# EAGLE design sighdo (EAGLE 5.10)
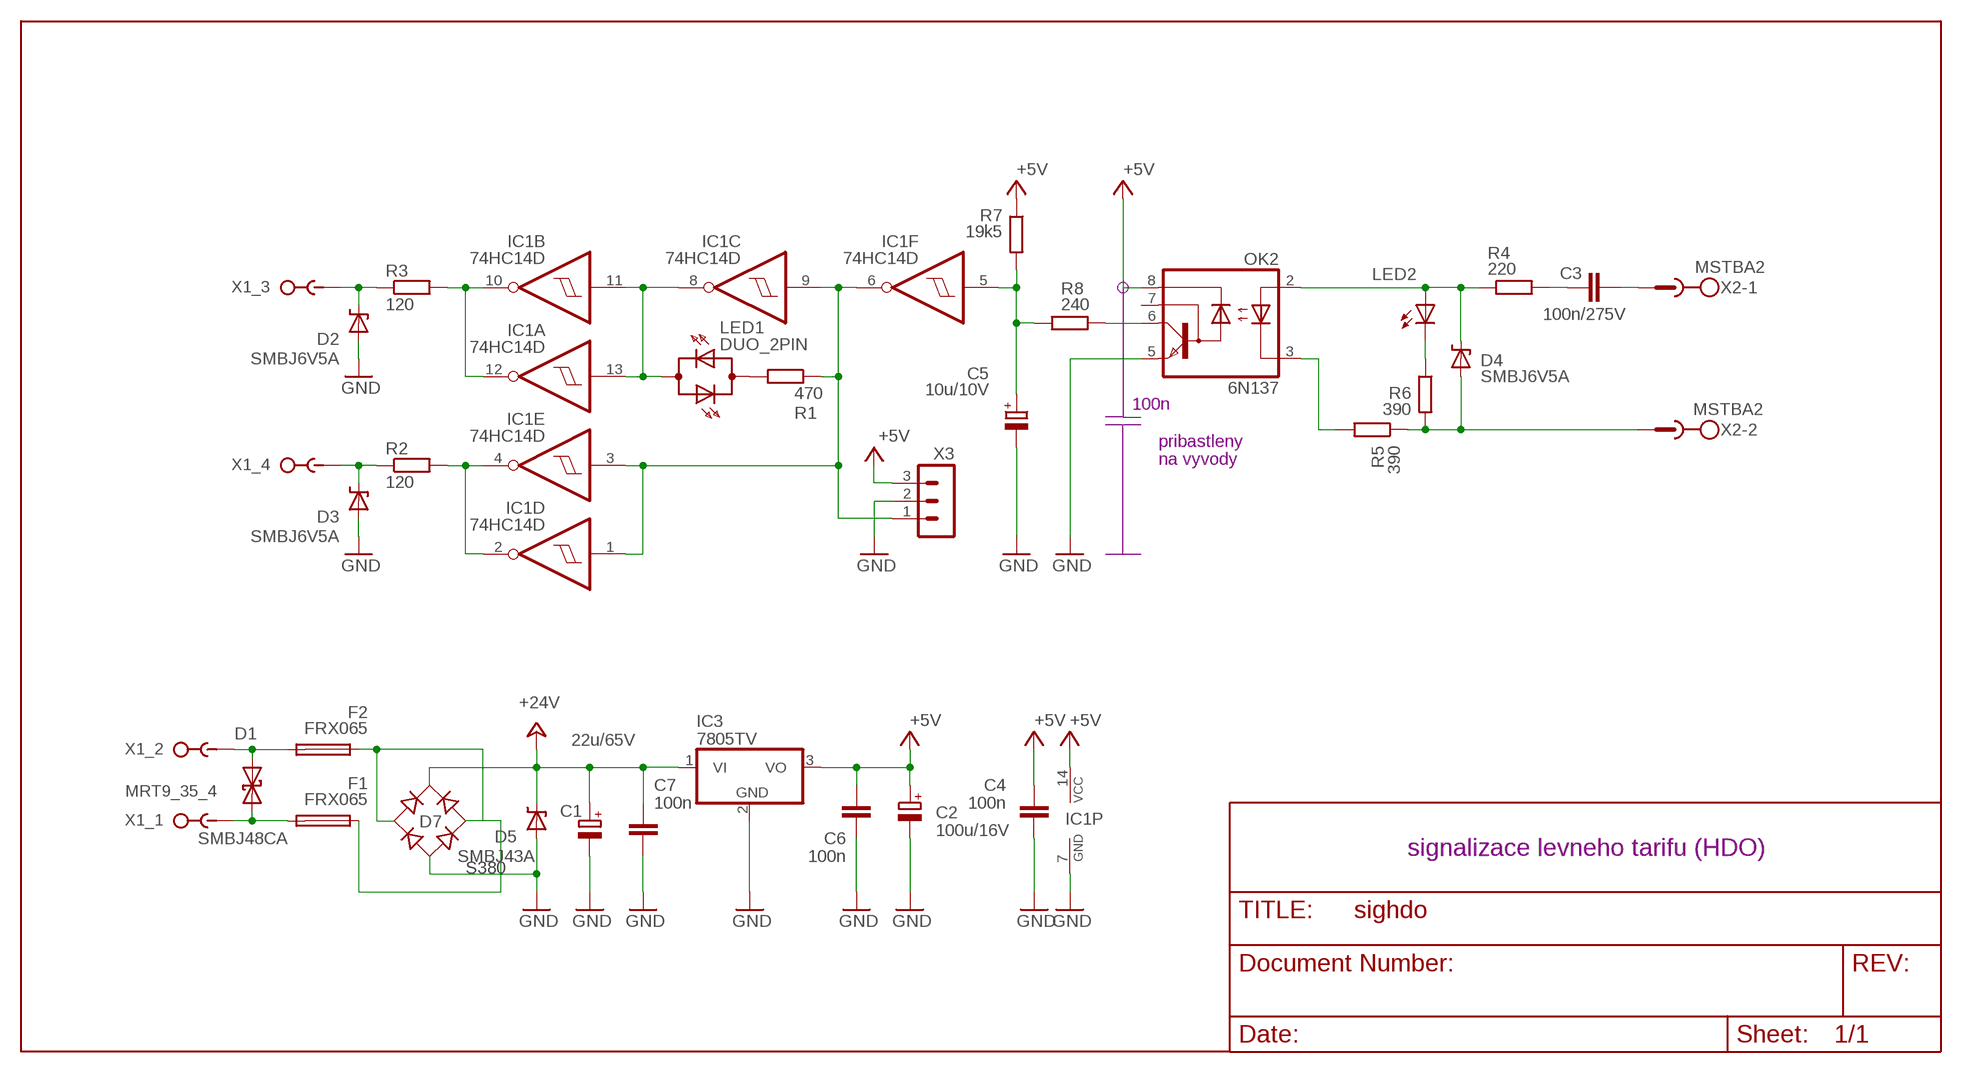
[diagram p0: schematic, sheet 1]

## Parts
C1  22u/65V  CPOL-EUE2-5  [E2-5]
C2  100u/16V  CPOL-EUE2-5  [E2-5]
C3  100n/275V  C-EU150-054X183  [C150-054X183]
C4  100n  C-SMD0805  [0805]
C5  10u/10V  CPOL-EUE2-5  [E2-5]
C6  100n  C-SMD0805  [0805]
C7  100n  C-SMD0805  [0805]
D1  SMBJ48CA  TRANZIL_BIDIRSMB_FW  [SMB_FW]
D2  SMBJ6V5A  SUPPRESSOR-  [SMBTR]
D3  SMBJ6V5A  SUPPRESSOR-  [SMBTR]
D4  SMBJ6V5A  SUPPRESSOR-  [SMBTR]
D5  SMBJ43A  SUPPRESSOR-  [SMBTR]
D7  S380  MUSTEKMINI-DIP  [MINI-DIP]
F1  FRX065  POLYSWITCHPOLYSW-FRX010  [POLYSW-FRX010]
F2  FRX065  POLYSWITCHPOLYSW-FRX010  [POLYSW-FRX010]
IC1  74HC14D  [SO14]
IC3  7805TV  [TO220V]
LED1  DUO_2PIN  [DUO_2PIN]
LED2  LED3MM  [LED3MM]
OK2  6N137  6N135  [DIL08]
R1  470  R0805  [R0805]
R2  120  R-EU_0207/7  [0207/7]
R3  120  R-EU_0207/7  [0207/7]
R4  220  R-EU_0207/7  [0207/7]
R5  390  R0805  [R0805]
R6  390  R0805  [R0805]
R7  19k5  R0805  [R0805]
R8  240  R0805  [R0805]
X1  MRT9_35_4  [MRT9_4_35]
X2  MSTBA2  [MSTBA2]
X3  MA03-1  [MA03-1]

## Nets
+5V: C2.+ C4.1 C6.1 IC1.14(P:VCC) IC3.3(VO) OK2.8(VCC) R7.1 X3.3
+24V: C1.+ C7.1 D5.C D7.++(+) IC3.1(VI)
GND: C1.- C2.- C4.2 C5.- C6.2 C7.2 D2.A D3.A D5.A D7.--(-) IC1.7(P:GND) IC3.2(GND) OK2.5(GND) X3.2
N$1: D7.AC2 F1.1
N$2: D1.A F2.2 X1.2
N$3: D7.AC1 F2.1
N$4: OK2.6(VO) R8.1
N$5: IC1.1(D:I) IC1.3(E:I) IC1.6(F:O) IC1.9(C:I) R1.1 X3.1
N$6: D1.C F1.2 X1.1
N$7: IC1.8(C:O) IC1.11(B:I) IC1.13(A:I) LED1.AK1(A)
N$8: C3.2 X2.1
N$9: C3.1 R4.2
N$10: IC1.2(D:O) IC1.4(E:O) R2.2
N$11: IC1.10(B:O) IC1.12(A:O) R3.2
N$13: LED1.AK2(C) R1.2
N$15: D2.C R3.1 X1.3
N$16: D3.C R2.1 X1.4
N$20: D4.C LED2.A OK2.2(A) R4.1
N$21: D4.A R5.1 R6.2 X2.2
N$22: OK2.3(C) R5.2
N$24: LED2.K(C) R6.1
N$25: C5.+ IC1.5(F:I) R7.2 R8.2
Unconnected: OK2.7(VB)

## Notes on the sheet
- 100n
- pribastleny
- na vyvody
- signalizace levneho tarifu (HDO)

## Library data of the parts
C1 C2 C5 = rcl:CPOL-EU: POLARIZED CAPACITOR, European symbol
C3 = rcl:C-EU: CAPACITOR, European symbol
C4 C6 C7 = keramicke kondenzatory SMD:C-SMD: Kondenzátory keramické SMD 50 V
D1 = diode:TRANZIL_BIDIR
D2-D5 = diode:SUPPRESSOR-: Suppressor diode
D7 = rectifier:MUSTEK
F1 F2 = fuse:POLYSWITCH
IC1 = 74xx-eu:74*14: Hex schmitt trigger INVERTER
IC3 = linear:78*: Positive VOLTAGE REGULATOR Source: http://cache.national.com/ds/LM/LM78L05.pdf http://www.fairchildsemi.com/ds/LM/LM7805.pdf
LED1 = led:DUO_2PIN
LED2 = led:LED: LED OSRAM: - CHIPLED LG R971, LG N971, LY N971, LG Q971, LY Q971, LO R971, LY R971 LH N974, LH R974 LS Q976, LO Q976, LY Q976 LO Q996 - Hyper CHIPLED LW Q18S LB Q993, LB Q99A, LB R99A - SideLED LS A670, LO A670, LY A670, LG A670, LP A670 LB A673, LV A673, LT A673, LW A673 LH A674 LY A675 LS A676, LA A676, LO A676, LY A676, LW A676 LS A679, LY A679, LG A679 - Hyper Micro SIDELED® LS Y876, LA Y876, LO Y876, LY Y876 LT Y87S - SmartLED LW L88C, LW L88S LB L89C, LB L89S, LG L890 LS L89K, LO L89K, LY L89K LS L896, LA L896, LO L896, LY L896 - TOPLED LS T670, LO T670, LY T670, LG T670, LP T670 LSG T670, LSP T670, LSY T670, LOP T670, LYG T670 LG T671, LOG T671, LSG T671 LB T673, LV T673, LT T673, LW T673 LH T674 LS T676, LA T676, LO T676, LY T676, LB T676, LH T676, LSB T676, LW T676 LB T67C, LV T67C, LT T67C, LS T67K, LO T67K, LY T67K, LW E67C LS E67B, LA E67B, LO E67B, LY E67B, LB E67C, LV E67C, LT E67C LW T67C LS T679, LY T679, LG T679 LS T770, LO T770, LY T770, LG T770, LP T770 LB T773, LV T773, LT T773, LW T773 LH T774 LS E675, LA E675, LY E675, LS T675 LS T776, LA T776, LO T776, LY T776, LB T776 LHGB T686 LT T68C, LB T68C - Hyper Mini TOPLED® LB M676 - Mini TOPLED Santana® LG M470 LS M47K, LO M47K, LY M47K Source: http://www.osram.convergy.de LUXEON: - LUMILED® LXK2-PW12-R00, LXK2-PW12-S00, LXK2-PW14-U00, LXK2-PW14-V00 LXK2-PM12-R00, LXK2-PM12-S00, LXK2-PM14-U00 LXK2-PE12-Q00, LXK2-PE12-R00, LXK2-PE12-S00, LXK2-PE14-T00, LXK2-PE14-U00 LXK2-PB12-K00, LXK2-PB12-L00, LXK2-PB12-M00, LXK2-PB14-N00, LXK2-PB14-P00, LXK2-PB14-Q00 LXK2-PR12-L00, LXK2-PR12-M00, LXK2-PR14-Q00, LXK2-PR14-R00 LXK2-PD12-Q00, LXK2-PD12-R00, LXK2-PD12-S00 LXK2-PH12-R00, LXK2-PH12-S00 LXK2-PL12-P00, LXK2-PL12-Q00, LXK2-PL12-R00 Source: www.luxeon.com KINGBRIGHT: KA-3528ASYC Source: www.kingbright.com
OK2 = optocoupler:6N135: MOTOROLA OPTO COUPLER
R1 R5-R8 = rezistory SMD:R0805: Rezistor SMD 0805
R2-R4 = rcl:R-EU_: RESISTOR, European symbol
X1 = con_mrt9:MRT9_35_4
X2 = con-phoenix-508:MSTBA2: PHOENIX
X3 = con-lstb:MA03-1: PIN HEADER

## Board
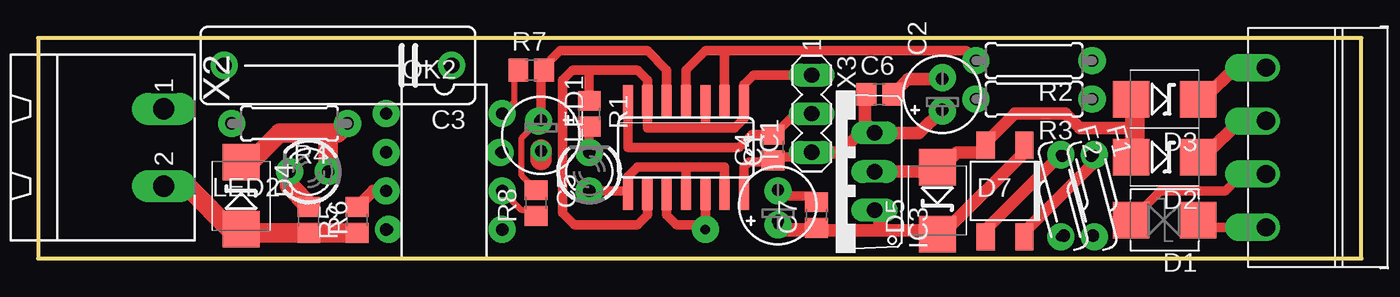
[diagram p1: board, top side]
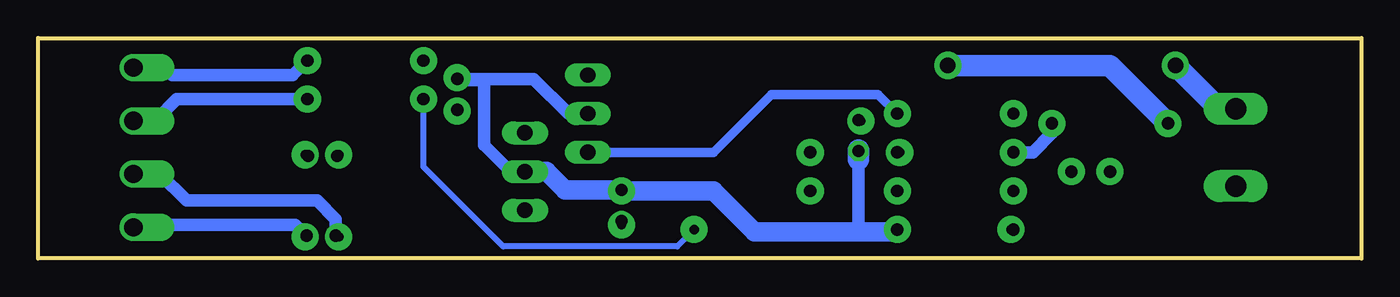
[diagram p2: board, bottom side, seen from below]

Size 86.9 x 14.5 mm. Coordinates in mm from the lower left corner, seen from the top.
Outline: 0,0 86.9,0 86.9,14.5 0,14.5 0,0
Copper layers (1*16): Top 0.035mm / dielectric 1.5mm / Bottom 0.035mm
Design rules "default": minimum track width 10mil, minimum drill 24mil, track to track 8mil, track to pad 8mil, pad to pad 8mil, via to via 8mil, smd to smd 8mil, copper to edge 40mil, drill to drill 8mil, minimum pad ring 10mil, minimum via ring 8mil, stop-mask expansion 4mil, vias tented up to drill 0mil, thermal gap 10mil

### Footprints (pad centres in the part's own frame; a part is rotated, then mirrored left to right if it is on the bottom)
E2-5 = drill 0.8 pad 1.27 round: + -1.016,0 | drill 0.8 pad 1.27 octagon: - 1.016,0
C150-054X183 = drill 1.016 octagon: 1 -7.493,0; 2 7.493,0
0805 = smd 1.3 x 1.5: 1 -0.85,0; 2 0.85,0
SMB_FW = smd 2.4 x 2.4: A 2.2,0; C -2.2,0
SMBTR = smd 2.4 x 2.4: A 2.2,0; C -2.2,0
MINI-DIP = smd 1.2 x 1.8: ++ 1.27,3.016; -- -1.27,3.016; AC1 -1.27,-3.016; AC2 1.27,-3.016
POLYSW-FRX010 = drill 0.8 octagon: 1 -0.635,-2.54; 2 0.635,2.54
SO14 = smd 0.66 x 2.032: 1 -3.81,-3.073; 2 -2.54,-3.073; 3 -1.27,-3.073; 4 0,-3.073; 5 1.27,-3.073; 6 2.54,-3.073; 7 3.81,-3.073; 8 3.81,3.073; 9 2.54,3.073; 10 1.27,3.073; 11 0,3.073; 12 -1.27,3.073; 13 -2.54,3.073; 14 -3.81,3.073
TO220V = drill 1.016 long: 1 -2.54,-2.54; 2 0,-2.54; 3 2.54,-2.54
DUO_2PIN = drill 0.813 octagon: AK1 -1.27,0; AK2 1.27,0
LED3MM = drill 0.813 octagon: A -1.27,0; K 1.27,0
DIL08 = drill 0.8 octagon: 1 -3.81,-3.81; 2 -1.27,-3.81; 3 1.27,-3.81; 4 3.81,-3.81; 5 3.81,3.81; 6 1.27,3.81; 7 -1.27,3.81; 8 -3.81,3.81
R0805 = smd 1.3 x 1.5: 1 -0.85,0; 2 0.85,0
0207/7 = drill 0.8 octagon: 1 -3.81,0; 2 3.81,0
MRT9_4_35 = drill 1.2 offset: 1 3.5,0; 2 0,0; 3 -3.5,0; 4 -7,0
MSTBA2 = drill 1.397 long: 1 -2.54,5.08; 2 2.54,5.08
MA03-1 = drill 1 long: 1 -2.54,0; 2 0,0; 3 2.54,0

### Placement (x,y rotation side)
C1  48.58,3.49 90 top
C2  59.37,10.79 90 top
C3  19.68,12.7 180 top
C4  48.26,7.3 90 top
C5  33.02,8.1 270 top
C6  55.24,10.79 0 top
C7  51.12,2.86 90 top
D1  73.98,2.54 180 top
D2  73.98,6.67 180 top
D3  73.98,10.48 180 top
D4  13.34,4.13 270 top
D5  59.05,3.81 90 top
D7  63.5,4.45 0 top
F1  69.22,4.13 195 top
F2  67.31,4.13 195 top
IC1  42.55,7.3 180 top
IC3  52.39,5.71 90 top
LED1  36.2,5.71 90 top
LED2  17.78,5.71 180 top
OK2  26.67,5.71 270 top
R1  36.2,9.53 270 top
R2  65.41,13.02 180 top
R3  65.41,10.48 180 top
R4  16.51,8.89 180 top
R5  20.95,2.54 90 top
R6  17.78,2.54 270 top
R7  32.38,12.38 0 top
R8  32.7,3.65 90 top
X1  80.64,5.56 270 top
X2  3.17,7.3 270 top
X3  50.8,9.53 270 top

### Tracks (layer width: path | path; a pad name or v marks a point on that pad's centre or on a via)
+5V
  Top 0.406: OK2.8 31.27,10.32 31.27,12.38 R7.1
  Top 0.61: IC1.14 46.35,6.03 46.67,6.35 48.26,6.35 C4.1 48.48,6.45 48.58,6.67 49.53,6.67 49.85,6.99 X3.3
  Top 0.813: IC3.3 53.98,8.26 52.7,6.99 X3.3 | C2.+ 57.85,8.26 IC3.3 | C6.1 54.29,10.79 54.29,8.95 54.45,8.79 IC3.3
  Bottom 0.61: OK2.8 31.75,10.79 38.73,10.79 42.55,6.99 X3.3
+24V
  Top 0.61: C7.1 48.9,2.01 C1.+
  Top 0.813: C1.+ 48.58,2.38 49.12,1.84 55.24,1.84 | 55.24,1.84 59.05,1.84 D5.C 59.05,2.06 59.21,1.75 59.53,1.75 64.77,6.99 D7.++ | IC3.1 55.24,3.17 55.24,1.84
GND
  Top 0.61: IC1.7 38.73,7.3 46.04,7.3 46.89,8.15 C4.2 48.36,8.15 49.73,9.53 X3.2 | C7.2 50.97,4.03 50.96,4.13 49.05,4.13 48.67,4.51 C1.-
  Top 0.813: 71.78,8.57 68.42,8.57 67.47,9.53 64.14,9.53 62.23,7.62 D7.-- 61.75,6.99 60.33,6.99 59.35,6.01 D5.A 58.76,5.71 IC3.2 | 71.78,8.57 72.25,10.16 72.25,6.67 | 71.78,8.57 D2.A | 71.78,8.57 D3.A | C6.2 57.11,11.81 C2.-
  Bottom 0.813: X3.2 52.07,9.53 54.36,11.81 C2.- 59.31,11.81 59.21,11.75 57.63,11.75 | 57.63,11.75 | 57.63,11.75 57.63,7.46 55.88,5.71 IC3.2 | 33.02,1.75 C5.-
  Bottom 1.27: IC3.2 53.5,5.71 52.29,4.51 C1.- 48.51,4.45 42.55,4.45 39.85,1.75 33.02,1.75 30.8,1.75 OK2.5 | OK2.5
N$1
  Top 0.813: F1.1 69.17,6.15 64.77,1.75 D7.AC2
N$2
  Top 0.61: D1.A 73.68,4.45 77.95,4.45 79.06,5.56 X1.2
  Bottom 0.813: F2.2 67.35,2.58 68.58,3.81 77.15,3.81 78.9,5.56 X1.2
N$3
  Top 0.813: F2.1 67.27,6.94 62.23,1.91 D7.AC1
N$4
  Top 0.406: R8.1 32.7,3.17 31.75,3.17 OK2.6 30.32,4.6
N$5
  Top 0.61: 43.81,8.57 IC1.3 | 43.81,8.57 40.01,8.57 IC1.6 40.01,11.75 39.37,12.38 36.2,12.38 | 43.81,8.57 45.72,8.57 46.35,9.21 IC1.1 46.35,11.43 46.99,12.06 X3.1 | 36.2,12.38 R1.1 | IC1.9 40.01,2.86 39.37,2.22 35.24,2.22 34.45,3.02 34.45,4.13 | 36.2,12.38 35.08,12.38 34.45,11.75 34.45,4.13 | 34.45,4.13
N$6
  Top 0.61: D1.C 76.66,2.06 X1.1
  Bottom 0.813: F1.2 69.3,1.51 70.01,2.22 80.17,2.22 80.33,2.06 80.58,2.15 X1.1
N$7
  Top 0.61: IC1.13 45.09,6.03 42.55,6.03 | 42.55,6.03 IC1.11 | 42.55,6.03 39.37,6.03 38.73,5.4 38.73,5.08 IC1.8 38.73,4.45 LED1.AK1
N$8
  Bottom 1.422: X2.1 9.34,9.84 C3.2
N$9
  Bottom 1.422: C3.1 16.51,12.7 R4.2
N$10
  Top 0.61: IC1.4 42.55,12.38 43.81,13.65 45.09,13.65 | 45.09,13.65 IC1.2 | 45.09,13.65 60.96,13.65 R2.2
N$11  (via drill 0.6 pad 1.78)
  Top 0.61: IC1.10 41.27,2.86 41.91,2.22 43.5,2.22 v43.81,1.91 IC1.12
  Bottom 0.406: R3.2 61.59,6.03 56.36,0.79 44.93,0.79 v43.81,1.91
N$12  (via drill 0.6 pad 1.78)
  other vias: 30.48,9.53
N$13
  Top 0.61: LED1.AK2 R1.2
N$14  (via drill 0.6 pad 1.78)
  other vias: 30.32,6.99
N$15
  Top 0.813: X1.3 79.06,9.21 76.52,6.67 D2.C
  Bottom 0.813: R3.1 77.79,10.48 79.05,9.21 X1.3
N$16
  Top 0.813: X1.4 80,12.7 78.74,12.7 76.52,10.48 D3.C
  Bottom 0.813: R2.1 70.17,12.06 78.11,12.06 78.75,12.71 X1.4
N$17  (via drill 0.6 pad 1.78)
  other vias: 30.48,4.45
N$18  (via drill 0.6 pad 1.78)
  other vias: 30.48,1.91
N$19  (via drill 0.6 pad 1.78)
  other vias: 23.02,1.91
N$20
  Top 1.27: D4.C 13.36,6.35 13.97,6.35 15.88,8.26 19.05,8.26 | 19.05,8.26 LED2.A | 19.05,8.26 19.68,8.26 R4.1
  Bottom 0.813: R4.1 20.32,8.26 21.59,6.99 OK2.2
N$21
  Top 1.27: R5.1 R6.2 12.86,1.69 | X2.2 9.74,4.87 9.37,4.76 9.79,4.76 12.86,1.69 | 12.86,1.69 D4.A
N$22
  Top 0.813: R5.2 22.01,4.45 OK2.3
N$23  (via drill 0.6 pad 1.78)
  other vias: 22.86,4.45
N$24
  Top 1.27: LED2.K 16.51,4.76 17.78,3.49 R6.1
N$25
  Top 0.406: R8.2 31.75,5.45 31.75,7.94 32.77,8.95 C5.+ | 33.02,12.06 R7.2
  Top 0.61: IC1.5 41.27,12.38 40.01,13.65 34.29,13.65 33.02,12.38 33.02,12.06 C5.+
N$26  (via drill 0.6 pad 1.78)
  other vias: 22.86,6.99
N$27  (via drill 0.6 pad 1.78)
  other vias: 22.86,9.53
N$28  (via drill 0.6 pad 1.78)
  other vias: 20.32,8.89
N$29  (via drill 0.6 pad 1.78)
  other vias: 12.7,8.89
N$30  (via drill 0.6 pad 1.78)
  other vias: 16.51,5.71
N$31  (via drill 0.6 pad 1.78)
  other vias: 19.05,5.71
N$32  (via drill 0.6 pad 1.78)
  other vias: 32.86,9.05
N$33  (via drill 0.6 pad 1.78)
  other vias: 12.22,12.7 8.26,9.84 8.26,4.76 80.64,5.56 80.64,2.06 80.64,9.05 80.64,12.54
N$34  (via drill 0.6 pad 1.78)
  other vias: 36.2,6.99
N$35  (via drill 0.6 pad 1.78)
  other vias: 36.2,4.45
N$36  (via drill 0.6 pad 1.78)
  other vias: 48.58,4.45
N$37  (via drill 0.6 pad 1.78)
  other vias: 48.58,2.22
N$38  (via drill 0.6 pad 1.78)
  other vias: 59.37,9.68
N$39  (via drill 0.6 pad 1.78)
  other vias: 59.37,11.91
N$40  (via drill 0.6 pad 1.78)
  other vias: 61.59,10.48
N$41  (via drill 0.6 pad 1.78)
  other vias: 61.59,13.02
N$42  (via drill 0.6 pad 1.78)
  other vias: 69.22,13.02
N$43  (via drill 0.6 pad 1.78)
  other vias: 69.22,10.48
N$44  (via drill 0.6 pad 1.78)
  other vias: 67.15,6.83
N$45  (via drill 0.6 pad 1.78)
  other vias: 69.37,1.43
N$46  (via drill 0.6 pad 1.78)
  other vias: 67.15,1.43
N$47  (via drill 0.6 pad 1.78)
  other vias: 69.37,6.83
N$48  (via drill 0.6 pad 1.78)
  other vias: 27.15,12.7
N$49
  Top 1.422: 33.02,7.14 33.02,6.51
  Bottom 1.422: 33.02,7.14 33.02,6.51

### Text on the board
Measures: 90.33 | 86.9 | 14.5